# Altium schematic sheet CM5_GPIO.SchDoc
size 420 x 297 mm; Organization: Q-Wave Systems Co.,Ltd; Address1: No.1; Address2: Suksawat 33/1; Address3: Ratburana; Address4: Bangkok Thailand
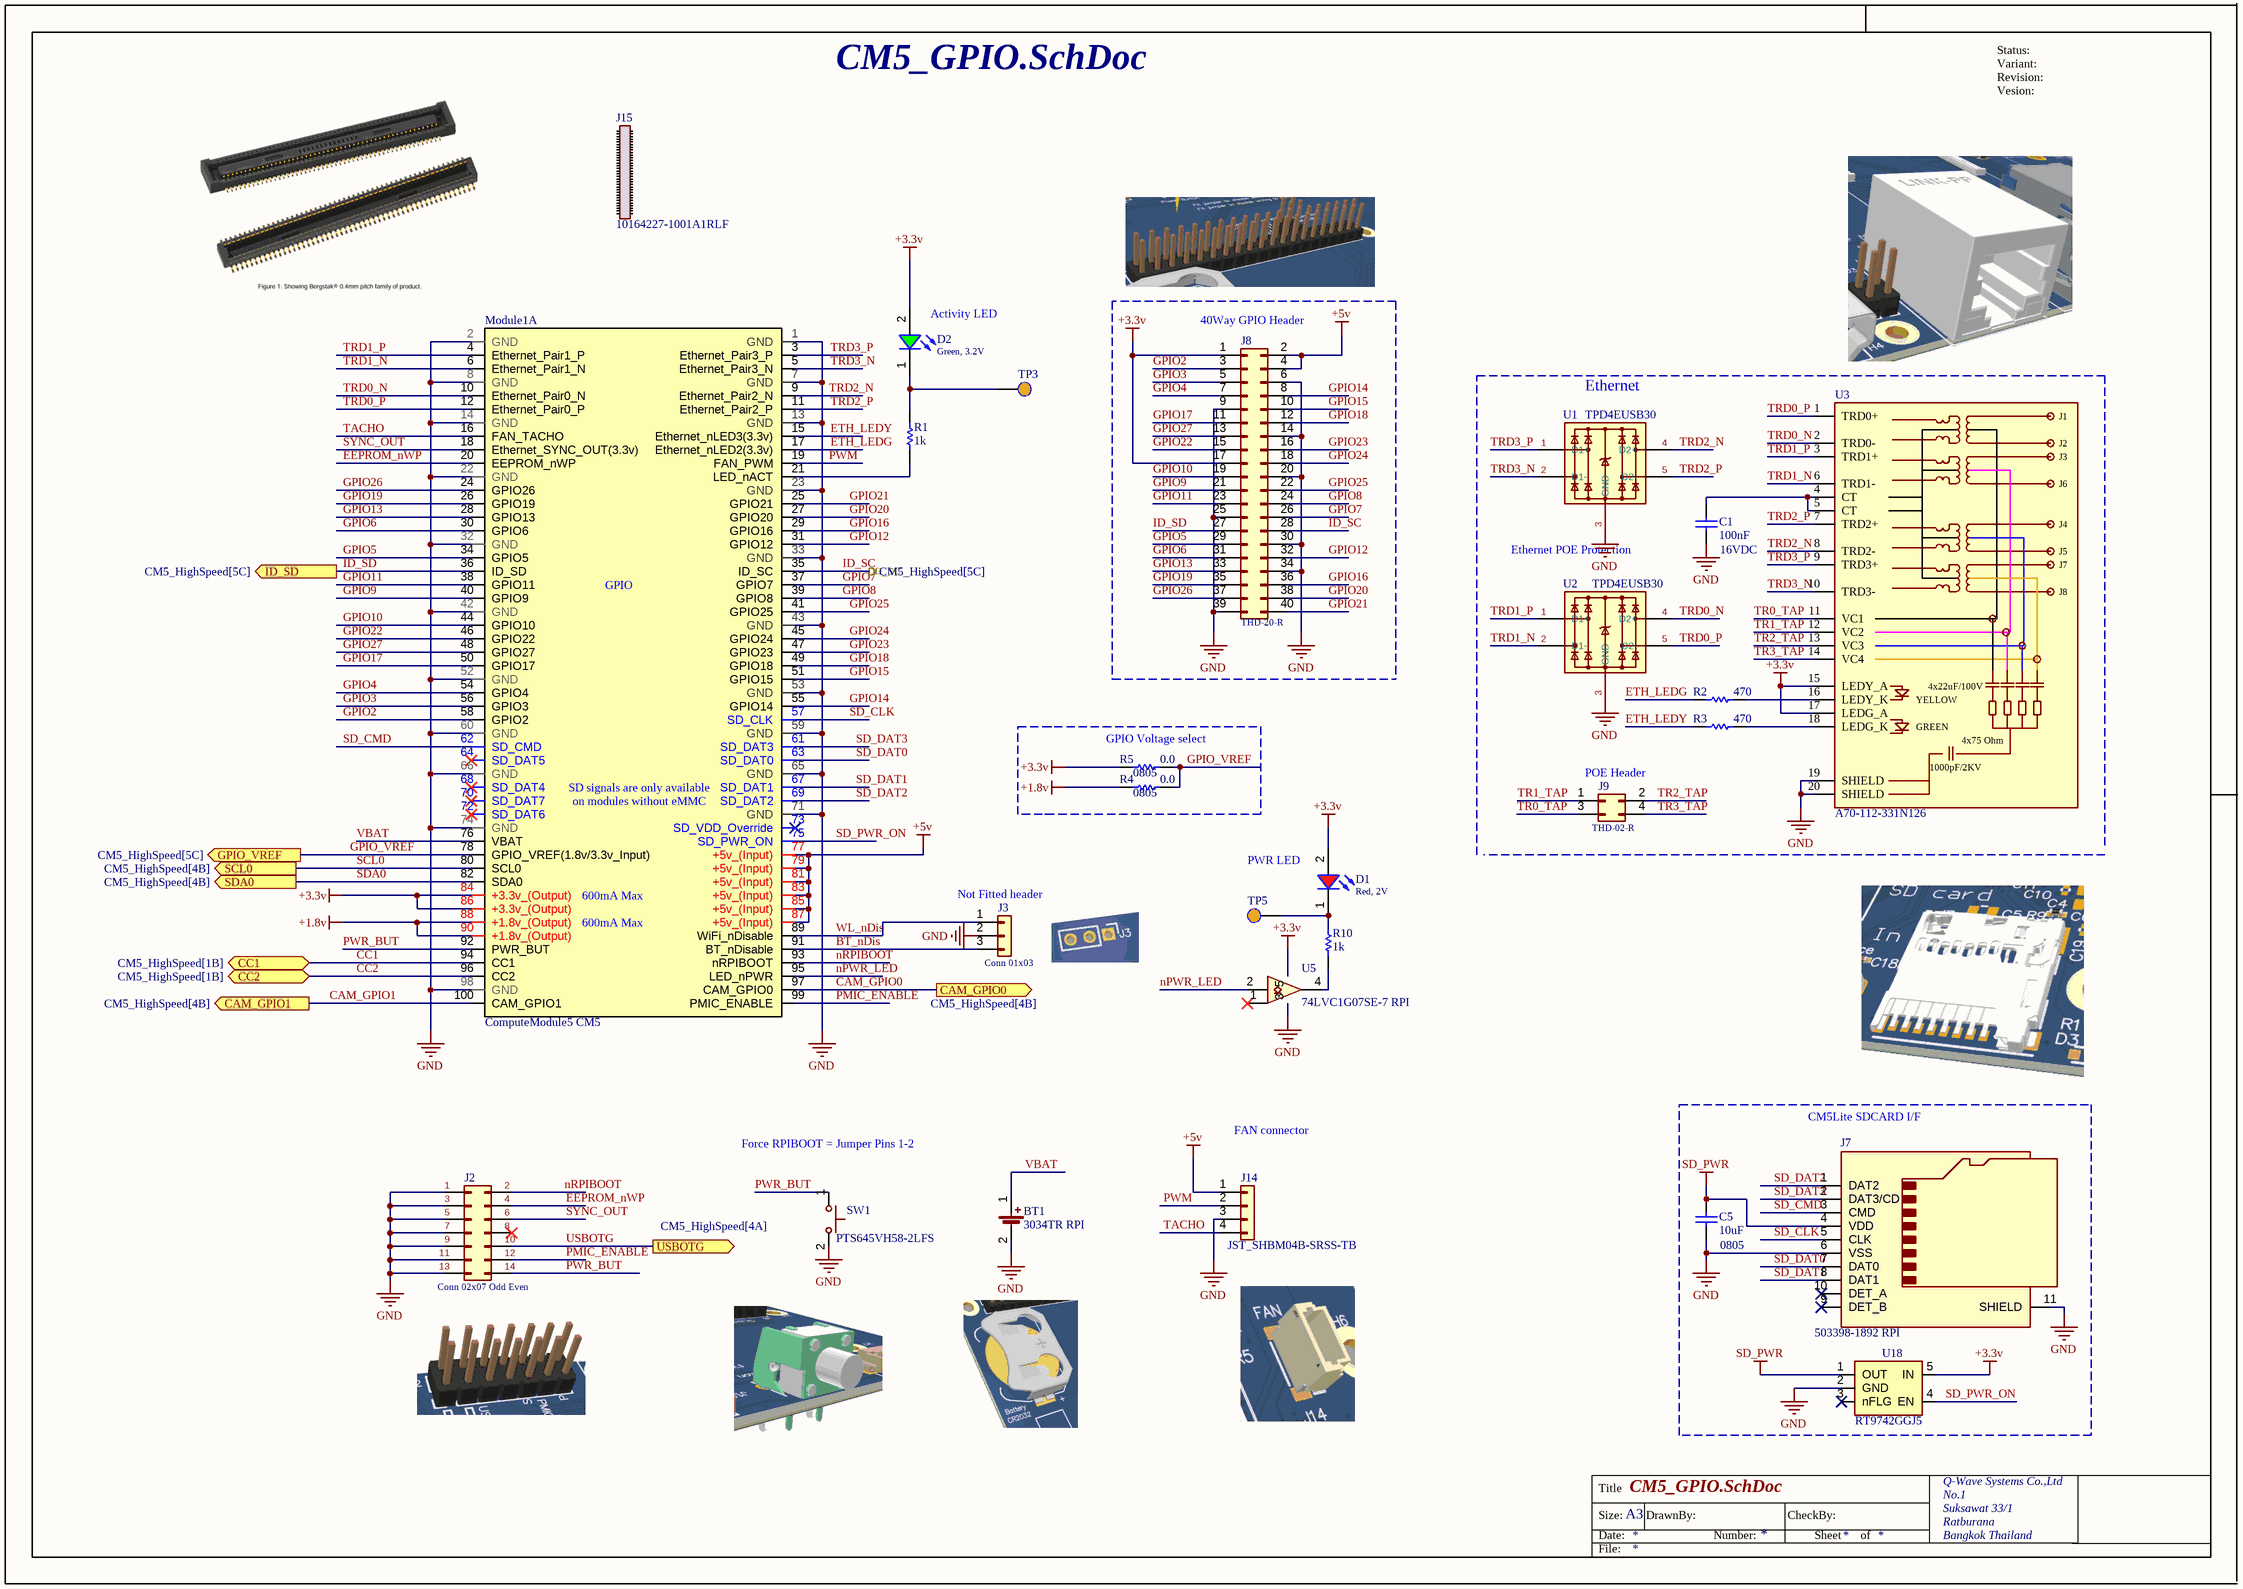
[diagram p0: CM5_GPIO.SchDoc]

## Parts
BT1  3034TR RPI  [3034TR RPI]
C1  value 100nF  Rated Voltage: 16VDC  [WCAP-CSGP_0402_H=0.5mm]  (hidden comment: 100nF, 16V)
C5  value 10uF  Size: 0805  [WCAP-CSGP_0805_H=1.25mm]  (hidden comment: 10uF, 16V)
D1  Red, 2V  [WL-SMCW_0603_H=0.7mm_Red]
D2  Green, 3.2V  [WL-SMCW_0603_H=0.7mm_Green]
J2  Conn 02x07 Odd Even  [Conn 02x07 Odd Even]
J3  Conn 01x03  [Conn 01x03]
J7  503398-1892 RPI  [503398-1892 RPI]
J8  THD-20-R  [THD-20-R]
J9  THD-02-R  [THD-02-R]
J14  JST_SHBM04B-SRSS-TB  [JST_SHBM04B-SRSS-TB]
J15  10164227-1001A1RLF  [CM5-BergStak-10164227]
Module1  ComputeModule5 CM5  [ComputeModule5-CM5]  (part A of 2)  (no BOM)
R1  value 1k  [SMD-0402-RES]  (hidden comment: RES SMD 1K OHM 1% 1/10W 0402)
R2  value 470  [SMD-0402-RES]  (hidden comment: RES SMD 470 OHM 1% 1/10W 0402)
R3  value 470  [SMD-0402-RES]  (hidden comment: RES SMD 470 OHM 1% 1/10W 0402)
R4  value 0.0  Supplier Device Package: 0805  [SMD-0805-RES]  (hidden comment: ERJ-6GEY0R00V)
R5  value 0.0  Supplier Device Package: 0805  [SMD-0805-RES]  (hidden comment: ERJ-6GEY0R00V)
R10  value 1k  [SMD-0402-RES]  (hidden comment: RES SMD 1K OHM 1% 1/10W 0402)
SW1  PTS645VH58-2LFS  [PTS645VH58-2LFS]
TP3  TEST_POINT 1  [TEST_POINT 1]  (value not drawn)  (no BOM)
TP5  TEST_POINT 1  [TEST_POINT 1]  (value not drawn)  (no BOM)
U1  TPD4EUSB30  [TPD4EUSB30]
U2  TPD4EUSB30  [TPD4EUSB30]
U3  A70-112-331N126  [A70-112-331N126]
U5  74LVC1G07SE-7 RPI  [74LVC1G07SE-7 RPI]
U18  RT9742GGJ5  [FP-RT9742GGJ5-IPC_A]

## Blocks framed on the sheet
40Way GPIO Header: J8
GPIO Voltage select: R4 R5
CM5Lite SDCARD I/F: C5 J7 U18

## Ports
CAM_GPIO0 (out, see CM5_HighSpeed[4B]), CAM_GPIO1 (out, see CM5_HighSpeed[4B]), CC1 (bidir, see CM5_HighSpeed[1B]), CC2 (bidir, see CM5_HighSpeed[1B]), GPIO_VREF (out, see CM5_HighSpeed[5C]), ID_SC (out, see CM5_HighSpeed[5C]), ID_SD (out, see CM5_HighSpeed[5C]), SCL0 (out, see CM5_HighSpeed[4B]), SDA0 (out, see CM5_HighSpeed[4B]), USBOTG (out, see CM5_HighSpeed[4A])

## Nets
+1.8v: Module1.88(+1.8v_(Output)) Module1.90(+1.8v_(Output)) R4.1
+3.3v: D1.2(A) D2.2(A) J8.1(Pin_1) J8.17(Pin_17) Module1.84(+3.3v_(Output)) Module1.86(+3.3v_(Output)) R5.1 U3.15(LEDY_A) U3.17(LEDG_A) U5.5(VCC) U18.5(IN)
+5v: J8.2(Pin_2) J8.4(Pin_4) J14.1(Pin_1) Module1.77(+5v_(Input)) Module1.79(+5v_(Input)) Module1.81(+5v_(Input)) Module1.83(+5v_(Input)) Module1.85(+5v_(Input)) Module1.87(+5v_(Input))
GND: BT1.2(-) C1.1 C5.1 J2.1(Pin_1) J2.3(Pin_3) J2.5(Pin_5) J2.7(Pin_7) J2.9(Pin_9) J2.11(Pin_11) J2.13(Pin_13) J3.2(Pin_2) J7.6(VSS) J7.11(SHIELD) J8.6(Pin_6) J8.9(Pin_9) J8.14(Pin_14) J8.20(Pin_20) J8.25(Pin_25) J8.30(Pin_30) J8.34(Pin_34) J8.39(Pin_39) J14.3(Pin_3) Module1.1(GND) Module1.2(GND) Module1.7(GND) Module1.8(GND) Module1.13(GND) Module1.14(GND) Module1.22(GND) Module1.23(GND) Module1.32(GND) Module1.33(GND) Module1.42(GND) Module1.43(GND) Module1.52(GND) Module1.53(GND) Module1.59(GND) Module1.60(GND) Module1.65(GND) Module1.66(GND) Module1.71(GND) Module1.74(GND) Module1.98(GND) SW1.2 U1.3(GND) U2.3(GND) U3.19(SHIELD) U3.20(SHIELD) U5.3(GND) U18.2(GND)
SD_PWR: C5.2 J7.4(VDD) U18.1(OUT)
BT_nDis: J3.3(Pin_3) Module1.91(BT_nDisable)
CAM_GPIO0: Module1.97(CAM_GPIO0) ; port CAM_GPIO0
CAM_GPIO1: Module1.100(CAM_GPIO1) ; port CAM_GPIO1
CC1: Module1.94(CC1) ; port CC1
CC2: Module1.96(CC2) ; port CC2
EEPROM_nWP: J2.4(Pin_4) Module1.20(EEPROM_nWP)
ETH_LEDG: Module1.17(Ethernet_nLED2(3.3v)) R2.1
ETH_LEDY: Module1.15(Ethernet_nLED3(3.3v)) R3.1
GPIO2: J8.3(Pin_3) Module1.58(GPIO2)
GPIO3: J8.5(Pin_5) Module1.56(GPIO3)
GPIO4: J8.7(Pin_7) Module1.54(GPIO4)
GPIO5: J8.29(Pin_29) Module1.34(GPIO5)
GPIO6: J8.31(Pin_31) Module1.30(GPIO6)
GPIO7: J8.26(Pin_26) Module1.37(GPIO7)
GPIO8: J8.24(Pin_24) Module1.39(GPIO8)
GPIO9: J8.21(Pin_21) Module1.40(GPIO9)
GPIO10: J8.19(Pin_19) Module1.44(GPIO10)
GPIO11: J8.23(Pin_23) Module1.38(GPIO11)
GPIO12: J8.32(Pin_32) Module1.31(GPIO12)
GPIO13: J8.33(Pin_33) Module1.28(GPIO13)
GPIO14: J8.8(Pin_8) Module1.55(GPIO14)
GPIO15: J8.10(Pin_10) Module1.51(GPIO15)
GPIO16: J8.36(Pin_36) Module1.29(GPIO16)
GPIO17: J8.11(Pin_11) Module1.50(GPIO17)
GPIO18: J8.12(Pin_12) Module1.49(GPIO18)
GPIO19: J8.35(Pin_35) Module1.26(GPIO19)
GPIO20: J8.38(Pin_38) Module1.27(GPIO20)
GPIO21: J8.40(Pin_40) Module1.25(GPIO21)
GPIO22: J8.15(Pin_15) Module1.46(GPIO22)
GPIO23: J8.16(Pin_16) Module1.47(GPIO23)
GPIO24: J8.18(Pin_18) Module1.45(GPIO24)
GPIO25: J8.22(Pin_22) Module1.41(GPIO25)
GPIO26: J8.37(Pin_37) Module1.24(GPIO26)
GPIO27: J8.13(Pin_13) Module1.48(GPIO27)
GPIO_VREF: Module1.78(GPIO_VREF(1.8v/3.3v_Input)) R4.2 R5.2 ; port GPIO_VREF
ID_SC: J8.28(Pin_28) Module1.35(ID_SC) ; port ID_SC
ID_SD: J8.27(Pin_27) Module1.36(ID_SD) ; port ID_SD
nPWR_LED: Module1.95(LED_nPWR) U5.2
nRPIBOOT: J2.2(Pin_2) Module1.93(nRPIBOOT)
PMIC_ENABLE: J2.12(Pin_12) Module1.99(PMIC_ENABLE)
PWM: J14.2(Pin_2) Module1.19(FAN_PWM)
PWR_BUT: J2.14(Pin_14) Module1.92(PWR_BUT) SW1.1
SCL0: Module1.80(SCL0) ; port SCL0
SD_CLK: J7.5(CLK) Module1.57(SD_CLK)
SD_CMD: J7.3(CMD) Module1.62(SD_CMD)
SD_DAT0: J7.7(DAT0) Module1.63(SD_DAT0)
SD_DAT1: J7.8(DAT1) Module1.67(SD_DAT1)
SD_DAT2: J7.1(DAT2) Module1.69(SD_DAT2)
SD_DAT3: J7.2(DAT3/CD) Module1.61(SD_DAT3)
SD_PWR_ON: Module1.75(SD_PWR_ON) U18.4(EN)
SDA0: Module1.82(SDA0) ; port SDA0
SYNC_OUT: J2.6(Pin_6) Module1.18(Ethernet_SYNC_OUT(3.3v))
TACHO: J14.4(Pin_4) Module1.16(FAN_TACHO)
TR0_TAP: J9.3(Pin_3) U3.11(VC1)
TR1_TAP: J9.1(Pin_1) U3.12(VC2)
TR2_TAP: J9.2(Pin_2) U3.13(VC3)
TR3_TAP: J9.4(Pin_4) U3.14(VC4)
TRD0_N: Module1.10(Ethernet_Pair0_N) U2.4(D2+) U3.2(TRD0-)
TRD0_P: Module1.12(Ethernet_Pair0_P) U2.5(D2-) U3.1(TRD0+)
TRD1_N: Module1.6(Ethernet_Pair1_N) U2.2(D1-) U3.6(TRD1-)
TRD1_P: Module1.4(Ethernet_Pair1_P) U2.1(D1+) U3.3(TRD1+)
TRD2_N: Module1.9(Ethernet_Pair2_N) U1.4(D2+) U3.8(TRD2-)
TRD2_P: Module1.11(Ethernet_Pair2_P) U1.5(D2-) U3.7(TRD2+)
TRD3_N: Module1.5(Ethernet_Pair3_N) U1.2(D1-) U3.10(TRD3-)
TRD3_P: Module1.3(Ethernet_Pair3_P) U1.1(D1+) U3.9(TRD3+)
USBOTG: J2.10(Pin_10) ; port USBOTG
VBAT: BT1.1(+) Module1.76(VBAT)
WL_nDis: J3.1(Pin_1) Module1.89(WiFi_nDisable)
NetC1_2: C1.2 U3.4(CT) U3.5(CT)
NetD1_1: D1.1(K) R10.2 TP5.1
NetD2_1: D2.1(K) R1.2 TP3.1
NetModule1_21: Module1.21(LED_nACT) R1.1
NetR2_2: R2.2 U3.16(LEDY_K)
NetR3_2: R3.2 U3.18(LEDG_K)
NetR10_1: R10.1 U5.4

Not connected (* = marked no-connect by the designer): J2 8(Pin_8)*; J7 9(DET_B)* 10(DET_A)*; Module1 64(SD_DAT5)* 68(SD_DAT4)* 70(SD_DAT7)* 72(SD_DAT6)* 73(SD_VDD_Override)*; U5 1(nc)*; U18 3(nFLG)*

## Notes on the sheet
- (near D2) Activity LED
- Ethernet
- Ethernet POE
  Protection
- (near J9) POE Header
- PWR LED
- (near J3) Not Fitted header
- FAN connector
- Force RPIBOOT = Jumper Pins 1-2
- Status:
- Revision:
- Variant:
- Vesion:
- Title
- Size:
- Date:
- A3
- DrawnBy:
- Number:
- CheckBy:
- Sheet
- of
- File:
- (in symbol CMP-002-00168-2) J1; J2; J3; J6; J4; J5; J7; J8; 4x22uF/100V; YELLOW; GREEN; 4x75 Ohm; 1000pF/2KV
- (in symbol CMP-633-000139-6, part A) GPIO; SD signals are only available; on modules without eMMC; 600mA Max

## Library data of the parts
BT1 = CMP-00029-00004-2: Coin Cell Battery Holders COIN CELL RETAINER T APE/REEL 500PC; Number of Batteries: 1; Number of Contacts: 2; Termination: SMD/SMT; Contact Material: Nickel; Series: -; Height: 4.31mm; Case/Package: SMD/SMT; Material: Bronze; Mounting Technology: Surface Mount,PCB; Package Quantity: 500; Packaging: Tape and Reel; Lead Free: Lead Free; Contact Plating: Tin; Number of Cells: 1
C1 = CMP-01409-2: WCAP-CSGP Multilayer Ceramic Chip Capacitor, General Purpose, size 0402, X5R, 100nF, 16V; Manufacturer Part Number: 885012105016; Manufacturer: Wurth Elektronik; Technical Reference: X5R0402104M016DFCT10000; Isolation Resistance  min.: 5GOhm; Dissipation Factor max.: 5%; Capacitance Tolerance: +/-20%; Published Date: April 2021; Height: 0.5mm; Operating Temperature: -55 to +85degC; Source: WCAP-CSGP_0402.SchLib; Packaging: Tape and Reel; Q-Factor min.: -; Component Type: Standard; Capacitance: 100nF; Ceramic Type: X5R; ComponentLink1Description: Manufacturer; ComponentLink1URL: http://www.we-online.de; ComponentLink2URL: https://www.we-online.com/catalog/datasheet/885012105016.pdf; Pin Count: 2; Size: 0402; Mounting Technology: SMT; Design Item ID: 885012105016; ComponentLink2Description: Datasheet
C5 = CMP-01449-2: WCAP-CSGP Multilayer Ceramic Chip Capacitor, General Purpose, size 0805, X5R, 10uF, 16V; Manufacturer: Wurth Elektronik; Manufacturer Part Number: 885012107014; Isolation Resistance  min.: 0.01GOhm; Dissipation Factor max.: 10%; Capacitance Tolerance: +/-20%; Technical Reference: X5R0805106M016DFCT10000; Rated Voltage: 16VDC; Packaging: Tape and Reel; ComponentLink2URL: https://www.we-online.com/catalog/datasheet/885012107014.pdf; Height: 1.25mm; Source: WCAP-CSGP_0805.SchLib; Design Item ID: 885012107014; ComponentLink2Description: Datasheet; Pin Count: 2; Capacitance: 10uF; ComponentLink1URL: http://www.we-online.de; Operating Temperature: -55 to +85degC; Published Date: April 2021; Mounting Technology: SMT; Ceramic Type: X5R; ComponentLink1Description: Manufacturer; Component Type: Standard; Q-Factor min.: -
D1 = CMP-00986-4: WL-SMCW SMT Mono-color Chip LED Waterclear, size 0603, Red, 2V, 140deg; Part Number: 150060RS75000; ES P/N: 0176-0439-6; Dominant Wavelength typ.: 625nm; SM P/N: 6949-59100742; Luminous Intensity typ.: 250mcd; Peak Wavelength typ.: 630nm; Chip Technology: AlInGaP; Component Type: Standard; Packaging: Tape and Reel; Publisher: Wurth Elektronik; Operating Temperature: -40 to +85degC; Forward Voltage typ.: 2V; Value: Red, 2V; Viewing Angle: 140deg; Design Item ID: 150060RS75000; Size: 0603; ComponentLink1URL: http://www.we-online.de; Emitting Color: Red; Mounting Technology: SMT; Source: WL-SMCW_0603.SchLib; ComponentLink2URL: https://www.we-online.com/catalog/datasheet/150060RS75000.pdf; ComponentLink2Description: Datasheet; ComponentLink1Description: Manufacturer; Pin Count: 2; Published Date: December 2019
D2 = CMP-00983-5: WL-SMCW SMT Mono-color Chip LED Waterclear, size 0603, Green, 3.2V, 140deg; Part Number: 150060GS75000; SM P/N: 59100121; Peak Wavelength typ.: 515nm; ES P/N: 0176-1070-9; Luminous Intensity typ.: 430mcd; Chip Technology: InGaN; Dominant Wavelength typ.: 525nm; Pin Count: 2; Forward Voltage typ.: 3.2V; Viewing Angle: 140deg; Packaging: Tape and Reel; Emitting Color: Green; Publisher: Wurth Elektronik; ComponentLink1URL: http://www.we-online.de; Source: WL-SMCW_0603.SchLib; ComponentLink2URL: https://www.we-online.com/catalog/datasheet/150060GS75000.pdf; ComponentLink2Description: Datasheet; Operating Temperature: -40 to +85degC; Design Item ID: 150060GS75000; Size: 0603; Mounting Technology: SMT; Published Date: December 2019; Value: Green, 3.2V; ComponentLink1Description: Manufacturer; Component Type: Standard
J2 = CMP-002-00171-1: PinHeader 2x07 P2.54mm Vertical; Manufacturer: Wurth Elektronik; Manufacturer Part Number: 61301421121; Pitch: 2.54mm; Pin Number: 14; Working Voltage: 250VAC; Contact Resistance: 20mOhm; Row Number: Dual; Withstanding Voltage: 500VAC; Value: 14; Rated Current: 3A; Design Item ID: 61301421121; Orientation: Vertical; Operating Temperature: -40 to +105degC; Gender: Pin Header; Component Type: Standard; ComponentLink2Description: Datasheet; Source: WR-PHD_Pin Header_2.54mm.SchLib; ComponentLink2URL: https://www.we-online.com/catalog/datasheet/61301421121.pdf; ComponentLink1URL: http://www.we-online.de; Mounting Technology: THT; Packaging: Bag; ComponentLink1Description: Manufacturer; Published Date: May 2020; Pin Count: 14
J3 = CMP-002-00173-1: PinHeader_1x03_P2.54mm_Vertical; Manufacturer: Wurth Elektronik; Manufacturer Part Number: 61300311121; Row Number: Single; Contact Resistance: 20mOhm; Value: 3; Rated Current: 3A; Pitch: 2.54mm; Working Voltage: 250VAC; Withstanding Voltage: 500VAC; Component Type: Standard; Design Item ID: 61300311121; Gender: Pin Header; Published Date: May 2020; ComponentLink1URL: http://www.we-online.de; Orientation: Vertical; Source: WR-PHD_Pin Header_2.54mm.SchLib; Operating Temperature: -40 to +105degC; Pin Count: 3; Pin Number: 3; ComponentLink1Description: Manufacturer; Packaging: Bag; Mounting Technology: THT; ComponentLink2Description: Datasheet; ComponentLink2URL: https://www.we-online.com/catalog/datasheet/61300311121.pdf
J7 = CMP-002-00170-1: 1.10mm Pitch microSD Memory Card Connector, Normal Mount Surface Mount, Push-Push Type, 1.28mm Height; Number of Circuits: 8; Voltage Rating (AC): 10V; Gender: Male; Current Rating: 500mA; Pitch: 1.1mm; Depth: 14.05mm; Number of Rows: 1; Max Operating Temperature: 85°C; Packaging: Tape and Reel; Housing Material: Thermoplastic; Orientation: Right Angle; Min Operating Temperature: -25°C; Mounting Technology: Surface Mount; Series: 503398; Halogen Free: Low Halogen; Reach SVHC Compliant: Unknown; Contact Material: Bronze,Stainless Steel; Package Quantity: 2400; Number of Contacts: 8; RoHS Compliant: Yes; Termination: Solder; Width: 14.05mm; Contact Plating: Gold; Length: 13.6mm
J8 = CMP-002-00167-3: Through hole straight pin header, 2x20, 2.54mm pitch, double rows; Manufacturer Part Number: 61304021121; Manufacturer: Wurth Elektronik; Working Voltage: 250VAC; Withstanding Voltage: 500VAC; Value: 40; Row Number: Dual; Contact Resistance: 20mOhm; Rated Current: 3A; Packaging: Bag; ComponentLink1URL: http://www.we-online.de; Pitch: 2.54mm; Gender: Pin Header; Component Type: Standard; Operating Temperature: -40 to +105degC; Pin Number: 40; Source: WR-PHD_Pin Header_2.54mm.SchLib; Mounting Technology: THT; ComponentLink1Description: Manufacturer; Orientation: Vertical; Pin Count: 40; Published Date: May 2020; ComponentLink2Description: Datasheet; ComponentLink2URL: https://www.we-online.com/catalog/datasheet/61304021121.pdf; Design Item ID: 61304021121
J9 = CMP-002-00174-1: PinHeader 2x02 P2.54mm Vertical; Manufacturer: Wurth Elektronik; Manufacturer Part Number: 61300421121; Rated Current: 3A; Pin Number: 4; Row Number: Dual; Withstanding Voltage: 500VAC; Pitch: 2.54mm; Contact Resistance: 20mOhm; Working Voltage: 250VAC; Value: 4; Gender: Pin Header; Published Date: May 2020; ComponentLink1Description: Manufacturer; Mounting Technology: THT; Orientation: Vertical; ComponentLink1URL: http://www.we-online.de; ComponentLink2Description: Datasheet; Pin Count: 4; ComponentLink2URL: https://www.we-online.com/catalog/datasheet/61300421121.pdf; Operating Temperature: -40 to +105degC; Component Type: Standard; Packaging: Bag; Source: WR-PHD_Pin Header_2.54mm.SchLib; Design Item ID: 61300421121
J14 = CMP-002-00172-1: Board Connector, 4 Contact(s), 1 Row(s), Male, Straight, Surface Mount Terminal; Pitch: 0.039inch; Number of Contacts: 4; Series: SR; Lead Free: Contains Lead; Housing Material: Nylon; Contact Plating: Tin,Lead; Number of Positions: 4; Contact Type: Male Pin; Contact Material: Copper Alloy; Mounting Technology: Surface Mount; Number of Rows: 1; Package Quantity: 1500; Termination: Solder; Orientation: Vertical; Housing Color: Natural; Color: Natural; Packaging: Cut Tape
J15 = CMP-634-000024-1: CM5 1.5mm Height 0.4MM Btb, 100P, Receptacle, 1.5MM Stack Height
Module1 = CMP-633-000139-6: Raspberry Pi Compute Module 5
R1 R10 = CMP-236-000247-2: Manufacturer: Panasonic Electronic Components; Part Number: ERJ-2RKF1001X; Factory Stock: 0; Unit Price (USD): 0.00496; Temperature Coefficient: ±100ppm/°C; Power (Watts): 0.1W, 1/10W; @ qty: 1500; Minimum Quantity: 1; Series: ERJ; Package / Case: 0402 (1005 Metric); Part Status: Active; Packaging: Cut Tape (CT); Number of Terminations: 2; Height - Seated (Max): 0.016" (0.40mm); Image: //media.digikey.com/Photos/Panasonic%20Photos/ERJ-PA2-Series.jpg; Quantity Available: 1787831; Datasheets: http://industrial.panasonic.com/www-cgi/jvcr13pz.cgi?E+PZ+3+AOA0002+ERJ2RKF1001X+7+WW; Failure Rate: -; Supplier Device Package: 0402; Tolerance: ±1%; Composition: Thick Film; Size / Dimension: 0.039" L x 0.020" W (1.00mm x 0.50mm); Features: Automotive AEC-Q200; Operating Temperature: -55°C ~ 155°C; Digi-Key Part Number: P1.00KLCT-ND
R2 R3 = CMP-236-000627-2: Part Number: ERJ-2RKF4700X; Manufacturer: Panasonic Electronic Components; Temperature Coefficient: ±100ppm/°C; Minimum Quantity: 1; @ qty: 1500; Unit Price (USD): 0.00496; Power (Watts): 0.1W, 1/10W; Factory Stock: 0; Packaging: Cut Tape (CT); Supplier Device Package: 0402; Part Status: Active; Series: ERJ; Features: Automotive AEC-Q200; Image: //media.digikey.com/Photos/Panasonic%20Photos/ERJ-PA2-Series.jpg; Operating Temperature: -55°C ~ 155°C; Number of Terminations: 2; Height - Seated (Max): 0.016" (0.40mm); Failure Rate: -; Digi-Key Part Number: P470LCT-ND; Tolerance: ±1%; Size / Dimension: 0.039" L x 0.020" W (1.00mm x 0.50mm); Package / Case: 0402 (1005 Metric); Datasheets: http://industrial.panasonic.com/www-cgi/jvcr13pz.cgi?E+PZ+3+AOA0002+ERJ2RKF4700X+7+WW; Quantity Available: 52644; Composition: Thick Film
R4 R5 = CMP-775-000874-3: RES SMD 0.0 OHM JUMPER 1/8W 0805; Manufacturer: Panasonic Electronic Components; @ qty: 1500; Factory Stock: 0; Unit Price (USD): 0.00544; Minimum Quantity: 1; Power (Watts): 0.125W, 1/8W; ES P/N: 0150-1835-2; Tolerance: Jumper; Source: Panasonic_ERJ_0805.SchLib; Part Number: ERJ-6GEY0R00V; Datasheets: http://industrial.panasonic.com/www-cgi/jvcr13pz.cgi?E+PZ+3+AOA0001+ERJ6GEY0R00V+7+WW; Image: //media.digikey.com/Renders/Panasonic%20Renders/ERJ-0805%20Pkg.jpg; Component Type: Standard; Operating Temperature: -55?C ~ 155?C; Packaging: Cut Tape (CT); Design Item ID: ERJ-6GEY0R00V; Failure Rate: -; Composition: Thick Film; Package / Case: 0805 (2012 Metric); Quantity Available: 1597627; Series: ERJ; Pin Count: 2; Number of Terminations: 2; Part Status: Active; Temperature Coefficient: -; Size / Dimension: 0.079" L x 0.049" W (2.00mm x 1.25mm); Height - Seated (Max): 0.028" (0.70mm); Features: Automotive AEC-Q200; Digi-Key Part Number: P0.0ACT-ND
SW1 = CMP-643-000011-1: PTS645 Series Compact 6 x 6 mm SPST 2 N Through Hole Tactile Switch; Switch Function: Off-Mom; Mechanical Life: 100000Cycles; Voltage Rating (DC): 12V; Operating Force: 200gf; Actuator Material: Nylon,Polyamide,PA66; Illumination Type: Non-Illuminated,Illuminated; Actuator Type: Standard; Max Current Rating: 50mA; Size: 2.5mm; Lead Free: Lead Free; Package Quantity: 1000; Termination: PC Pin; Min Operating Temperature: -20°C; Reach SVHC Compliant: No; Contact Material: Brass,Silver; Max Operating Temperature: 60°C; Contact Plating: Silver; Length: 7.5mm; Color: Black; Packaging: Bulk; RoHS Compliant: Yes; Throw Configuration: SPST; Depth: 9.8mm; Mounting Technology: Through Hole; Series: PTS645; Current Rating: 50mA; Orientation: Right Angle
TP3 TP5 = CMP-633-000141-1: Test Point SMT PAD; Component Type: Standard (No BOM); Pin Count: 1; Design Item ID: TEST_POINT
U1 U2 = CMP-02720-1: TEXAS INSTRUMENTS         TPD4EUSB30DQAR             ESD Protection Device, Array, 8 V, SON, 10 Pins; Current Rating: 5A; ESD Protection: Yes; Peak Pulse Current: 1A; ES P/N: 0086-0901-1; SM P/N: 6949-44043002; Capacitance: 0.8pF; Breakdown Voltage: 7V; Reverse Standoff Voltage: 5.5V; Min Breakdown Voltage: 8V; Interface: USB; Data Rate: 6Gbps; Number of Bidirectional Channels: 4; Direction: Unidirectional; Peak Pulse Power: 45W; Termination: SMD/SMT; Length: 2.5mm; Radiation Hardening: No; Number of Pins: 10; Package Quantity: 1; Packaging: Tape and Reel; Height: 0.5mm; Working Voltage: 5.5V; Lead Free: Lead Free; Max Operating Temperature: 85°C; Depth: 1mm; Min Operating Temperature: -40°C; REACH SVHC: No SVHC; RoHS Compliant: Yes; Clamping Voltage: 8V; Width: 1.1mm; Number of Channels: 4; Power Line Protection: Yes
U3 = CMP-002-00168-2: TRJG0926HENL Single Port Ethernet(PoE+) RJ45 Female Connector with 10/100/1000 Base-T Integrated Magnetics, Green/Yellow LED, Tab Down, RoHS; TE P/N: 5-2337992-8; ComponentLink1Description: https://www.l-p.com/sale-432379-link-pp-lpjg0926henl-cross-a70-112-331n126-edac.htm; EDAC P/N: A70-112-331N126; ComponentLink1URL: https://www.l-p.com/upload/file/2019/11-26/002050785.pdf; ComponentLink2Description: TRXCOM; ComponentLink2URL: https://p.globalsources.com/IMAGES/PDT/SPEC/690/K1160305690.pdf
U5 = CMP-633-000142-2: 74LVC Series 5.5 V Surface Mount Single Buffer with Open Drain Output - SOT-353; Polarity: Inverting,Non-Inverting; Number of Input Lines: 1; Max Supply Voltage: 5.5V; Logic Function: Buffer,Inverting; Turn-On Delay Time: 8.5ns; Quiescent Current: 200uA; Min Supply Voltage: 1.65V; Low Level Output Current: 32mA; Propagation Delay: 3ns; Operating Supply Current: 10uA; Package Quantity: 3000; Technology: CMOS; Number of Channels: 1; Reach SVHC Compliant: No; RoHS Compliant: Yes; Case/Package: SOT-353; Mounting Technology: Surface Mount; Number of Elements: 1; Length: 2.2mm; Min Operating Temperature: -40°C; Pins: 5; Max Operating Temperature: 85°C; Number of Inputs: 1; Width: 1.35mm; Number of Gates: 1; Number of Outputs: 1; Packaging: Tape and Reel; Series: 74LVC; Number of Output Lines: 1; Lead Free: Lead Free; Number of Bits per Element: 1; Height: 1mm; Radiation Hardening: No
U18 = CMP-000462-2: IC Pwr Swtch N-chan 1: 1 TSOT23-5; Output Configuration: High Side; Max Output current: 1A; Interface: On/Off; On-State Resistance: 70mR; Fault Protection: Over Temperature,Reverse Current; Number of Outputs: 1; Series: -; Reach SVHC Compliant: No; Case/Package: SOT-23-5; Max Operating Temperature: 85°C; Min Operating Temperature: -40°C; Pins: 23; Packaging: Cut Tape; RoHS Compliant: Yes